# Altium project ctrl_board.PrjPCB
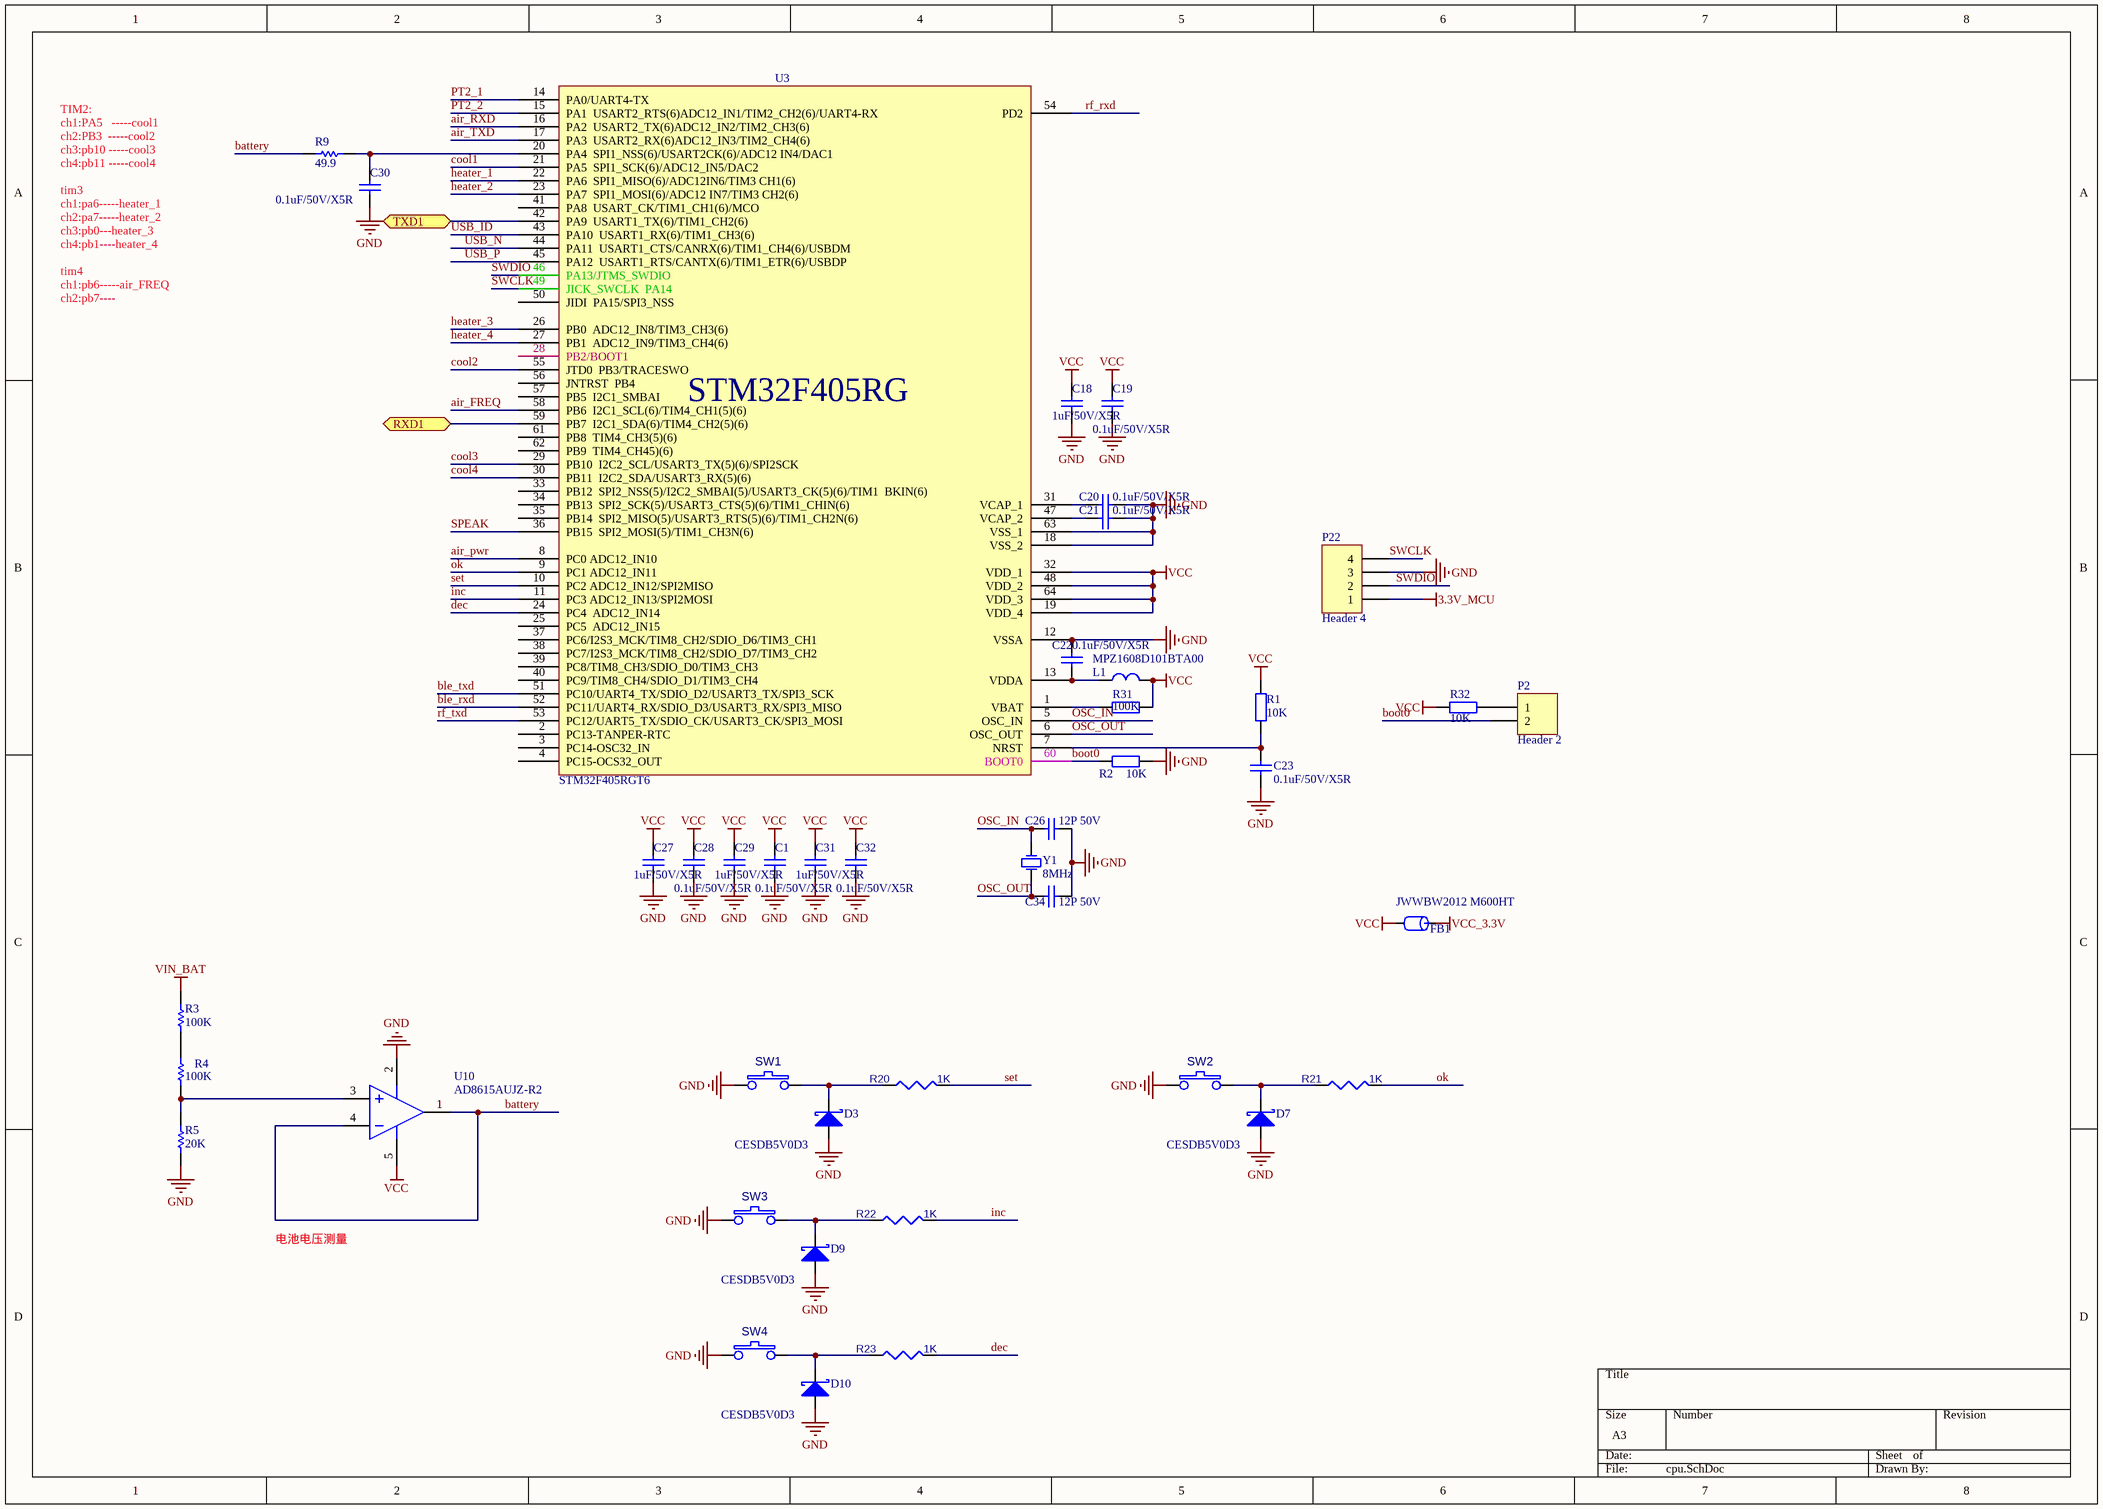
[diagram p0: cpu.SchDoc]
5 sheets, 103 parts. Net scope: global (net labels, ports and power ports of the same name join across sheets).
Board file: ctrl_board.PcbDoc
Sheets:
  cpu.SchDoc
  connector.SchDoc
  power.SchDoc
  drv.SchDoc
  pt100.SchDoc

## Sheet cpu.SchDoc
size A3

### Parts
C1  0.1uF/50V/X5R  [0603C]
C18  1uF/50V/X5R  [0603C]
C19  0.1uF/50V/X5R  [0603C]
C20  0.1uF/50V/X5R  [0603C]
C21  0.1uF/50V/X5R  [0603C]
C22  0.1uF/50V/X5R  [0603C]
C23  0.1uF/50V/X5R  [0603C]
C26  12P 50V  [0603C]
C27  1uF/50V/X5R  [0603C]
C28  0.1uF/50V/X5R  [0603C]
C29  1uF/50V/X5R  [0603C]
C30  0.1uF/50V/X5R  [0603C]
C31  1uF/50V/X5R  [0603C]
C32  0.1uF/50V/X5R  [0603C]
C34  12P 50V  [0603C]
D3  CESDB5V0D3  [SOD323]
D7  CESDB5V0D3  [SOD323]
D9  CESDB5V0D3  [SOD323]
D10  CESDB5V0D3  [SOD323]
FB1  JWWBW2012 M600HT  [0805CZ]
L1  MPZ1608D101BTA00  [0603R]
P2  Header 2  [HDR1X2]
P22  Header 4  [HDR1X4]
R1  10K  [0603R]
R2  10K  [0603R]
R3  100K  [0603R]
R4  100K  [0603R]
R5  20K  [0603R]
R9  49.9  [0603R]
R20  value 1K  [0603R]  (hidden comment: 1k/1%)
R21  value 1K  [0603R]  (hidden comment: 1k/1%)
R22  value 1K  [0603R]  (hidden comment: 1k/1%)
R23  value 1K  [0603R]  (hidden comment: 1k/1%)
R31  100K  [0603R]
R32  10K  [0603R]
SW1  SW PUSHBUTTON  [SW-SMD_L3.9-W3.0-P4.45]  (value not drawn)
SW2  SW PUSHBUTTON  [SW-SMD_L3.9-W3.0-P4.45]  (value not drawn)
SW3  SW PUSHBUTTON  [SW-SMD_L3.9-W3.0-P4.45]  (value not drawn)
SW4  SW PUSHBUTTON  [SW-SMD_L3.9-W3.0-P4.45]  (value not drawn)
U3  STM32F405RGT6  [LQFP-64]
U10  AD8615AUJZ-R2  [sot-23-5]
Y1  8MHz  [CRAY_5032]

### Ports
RXD1 (bidir), TXD1 (bidir)

### Nets
3.3V_MCU: P22.1
GND: C1.1 C18.1 C19.1 C20.1 C21.1 C22.1 C23.1 C26.1 C27.1 C28.1 C29.1 C30.1 C31.1 C32.1 C34.1 D3.1(A) D7.1(A) D9.1(A) D10.1(A) P22.3 R2.2 R5.2 SW1.1 SW2.1 SW3.1 SW4.1 U3.12(VSSA) U3.18(VSS_2) U3.63(VSS_1) U10.2(G)
VCC: C1.2 C18.2 C19.2 C27.2 C28.2 C29.2 C31.2 C32.2 FB1.2 L1.2 R1.1 R31.1 R32.2 U3.19(VDD_4) U3.32(VDD_1) U3.48(VDD_2) U3.64(VDD_3) U10.5(VCC)  [project net PT_VREF]
VCC_3.3V: FB1.1
VIN_BAT: R3.1
air_FREQ: U3.58(PB6__I2C1_SCL(6)/TIM4_CH1(5)(6))
air_pwr: U3.8(PC0_ADC12_IN10)
air_RXD: U3.16(PA2__USART2_TX(6)ADC12_IN2/TIM2_CH3(6))
air_TXD: U3.17(PA3__USART2_RX(6)ADC12_IN3/TIM2_CH4(6))
battery: R9.1 U10.1(OS_NUL) U10.4(V-)
ble_rxd: U3.52(PC11/UART4_RX/SDIO_D3/USART3_RX/SPI3_MISO)
ble_txd: U3.51(PC10/UART4_TX/SDIO_D2/USART3_TX/SPI3_SCK)
boot0: P2.2 R2.1 U3.60(BOOT0)
cool1: U3.21(PA5__SPI1_SCK(6)/ADC12_IN5/DAC2)
cool2: U3.55(JTD0__PB3/TRACESWO)
cool3: U3.29(PB10__I2C2_SCL/USART3_TX(5)(6)/SPI2SCK)
cool4: U3.30(PB11__I2C2_SDA/USART3_RX(5)(6))
dec: R23.2 U3.24(PC4__ADC12_IN14)
heater_1: U3.22(PA6__SPI1_MISO(6)/ADC12IN6/TIM3_CH1(6))
heater_2: U3.23(PA7__SPI1_MOSI(6)/ADC12_IN7/TIM3_CH2(6))
heater_3: U3.26(PB0__ADC12_IN8/TIM3_CH3(6))
heater_4: U3.27(PB1__ADC12_IN9/TIM3_CH4(6))
inc: R22.2 U3.11(PC3_ADC12_IN13/SPI2MOSI)
ok: R21.2 U3.9(PC1_ADC12_IN11)
OSC_IN: C26.2 U3.5(OSC_IN) Y1.2(OSC2)
OSC_OUT: C34.2 U3.6(OSC_OUT) Y1.1(OSC1)
PT2_1: U3.14(PA0/UART4-TX)
PT2_2: U3.15(PA1__USART2_RTS(6)ADC12_IN1/TIM2_CH2(6)/UART4-RX)
rf_rxd: U3.54(PD2)
rf_txd: U3.53(PC12/UART5_TX/SDIO_CK/USART3_CK/SPI3_MOSI)
set: R20.2 U3.10(PC2_ADC12_IN12/SPI2MISO)
SPEAK: U3.36(PB15__SPI2_MOSI(5)/TIM1_CH3N(6))
SWCLK: P22.4 U3.49(JICK_SWCLK__PA14)
SWDIO: P22.2 U3.46(PA13/JTMS_SWDIO)
USB_ID: U3.43(PA10__USART1_RX(6)/TIM1_CH3(6))
USB_N: U3.44(PA11__USART1_CTS/CANRX(6)/TIM1_CH4(6)/USBDM)
USB_P: U3.45(PA12__USART1_RTS/CANTX(6)/TIM1_ETR(6)/USBDP)
NetC20_2: C20.2 U3.31(VCAP_1)
NetC21_2: C21.2 U3.47(VCAP_2)
NetC22_2: C22.2 L1.1 U3.13(VDDA)
NetC23_2: C23.2 R1.2 U3.7(NRST)
NetC30_2: C30.2 R9.2 U3.20(PA4__SPI1_NSS(6)/USART2CK(6)/ADC12_IN4/DAC1)
NetD3_2: D3.2(K) R20.1 SW1.2
NetD7_2: D7.2(K) R21.1 SW2.2
NetD9_2: D9.2(K) R22.1 SW3.2
NetD10_2: D10.2(K) R23.1 SW4.2
NetP2_1: P2.1 R32.1
NetR3_2: R3.2 R4.1
NetR4_2: R4.2 R5.1 U10.3(V+)
NetR10_2: U3.42(PA9__USART1_TX(6)/TIM1_CH2(6)) ; port TXD1
NetR31_2: R31.2 U3.1(VBAT)
NetR63_2: U3.59(PB7__I2C1_SDA(6)/TIM4_CH2(5)(6)) ; port RXD1

Not connected (* = marked no-connect by the designer): U3 2(PC13-TANPER-RTC) 3(PC14-OSC32_IN) 4(PC15-OCS32_OUT) 25(PC5__ADC12_IN15) 28(PB2/BOOT1) 33(PB12__SPI2_NSS(5)/I2C2_SMBAI(5)/USART3_CK(5)(6)/TIM1__BKIN(6)) 34(PB13__SPI2_SCK(5)/USART3_CTS(5)(6)/TIM1_CHIN(6)) 35(PB14__SPI2_MISO(5)/USART3_RTS(5)(6)/TIM1_CH2N(6)) 37(PC6/I2S3_MCK/TIM8_CH2/SDIO_D6/TIM3_CH1) 38(PC7/I2S3_MCK/TIM8_CH2/SDIO_D7/TIM3_CH2) 39(PC8/TIM8_CH3/SDIO_D0/TIM3_CH3) 40(PC9/TIM8_CH4/SDIO_D1/TIM3_CH4) 41(PA8__USART_CK/TIM1_CH1(6)/MCO) 50(JIDI__PA15/SPI3_NSS) 56(JNTRST__PB4) 57(PB5__I2C1_SMBAI) 61(PB8__TIM4_CH3(5)(6)) 62(PB9__TIM4_CH45)(6))

### Notes on the sheet
- TIM2:
  ch1:PA5   -----cool1
  ch2:PB3  -----cool2
  ch3:pb10 -----cool3
  ch4:pb11 -----cool4
  tim3
  ch1:pa6-----heater_1
  ch2:pa7-----heater_2
  ch3:pb0---heater_3
  ch4:pb1----heater_4
  tim4
  ch1:pb6-----air_FREQ
  ch2:pb7----
- 电池电压测量

### Library data of the parts
C1 C18-C23 C26-C32 C34 = CAP4: 贴片电容 20%
D3 D7 D9 D10 = DIODE S: Schottky Diode
FB1 = FB: Part Field 1: 磁珠/0603/1K ohm/100MHz; Text Field1: FB; Value: JWWBW2012 M600HT
L1 = CIZHU1: 磁珠电感 100R 100MHz
P2 = Header 2: Header, 2-Pin; LatestRevisionDate: 17-Jul-2002; LatestRevisionNote: Re-released for DXP Platform.; Publisher: Altium Limited
P22 = Header 4: Header, 4-Pin; LatestRevisionDate: 17-Jul-2002; LatestRevisionNote: Re-released for DXP Platform.; Publisher: Altium Limited
R1 R2 R31 R32 = RES2: 贴片电阻 5%
R3-R5 R9 = Res1: Resistor; Published: 8-Jun-2000; LatestRevisionDate: 17-Jul-2002; LatestRevisionNote: Re-released for DXP Platform.; PackageReference: AXIAL-0.3; Publisher: Altium Limited
R20-R23 = RESISTOR_0: Part Reference: R70; SIGNAL_MODEL: DEFAULT_RESISTOR_200OHM_1_2; PCB Footprint: R0402
SW1-SW4 = SW PUSHBUTTON: Part Reference: SW2; PCB Footprint: KEY_3X6; Value: SW PUSHBUTTON
U3 = STM32F405RG: MCU
U10 = AD8615
Y1 = XTAL: 晶振

## Sheet connector.SchDoc
size A4
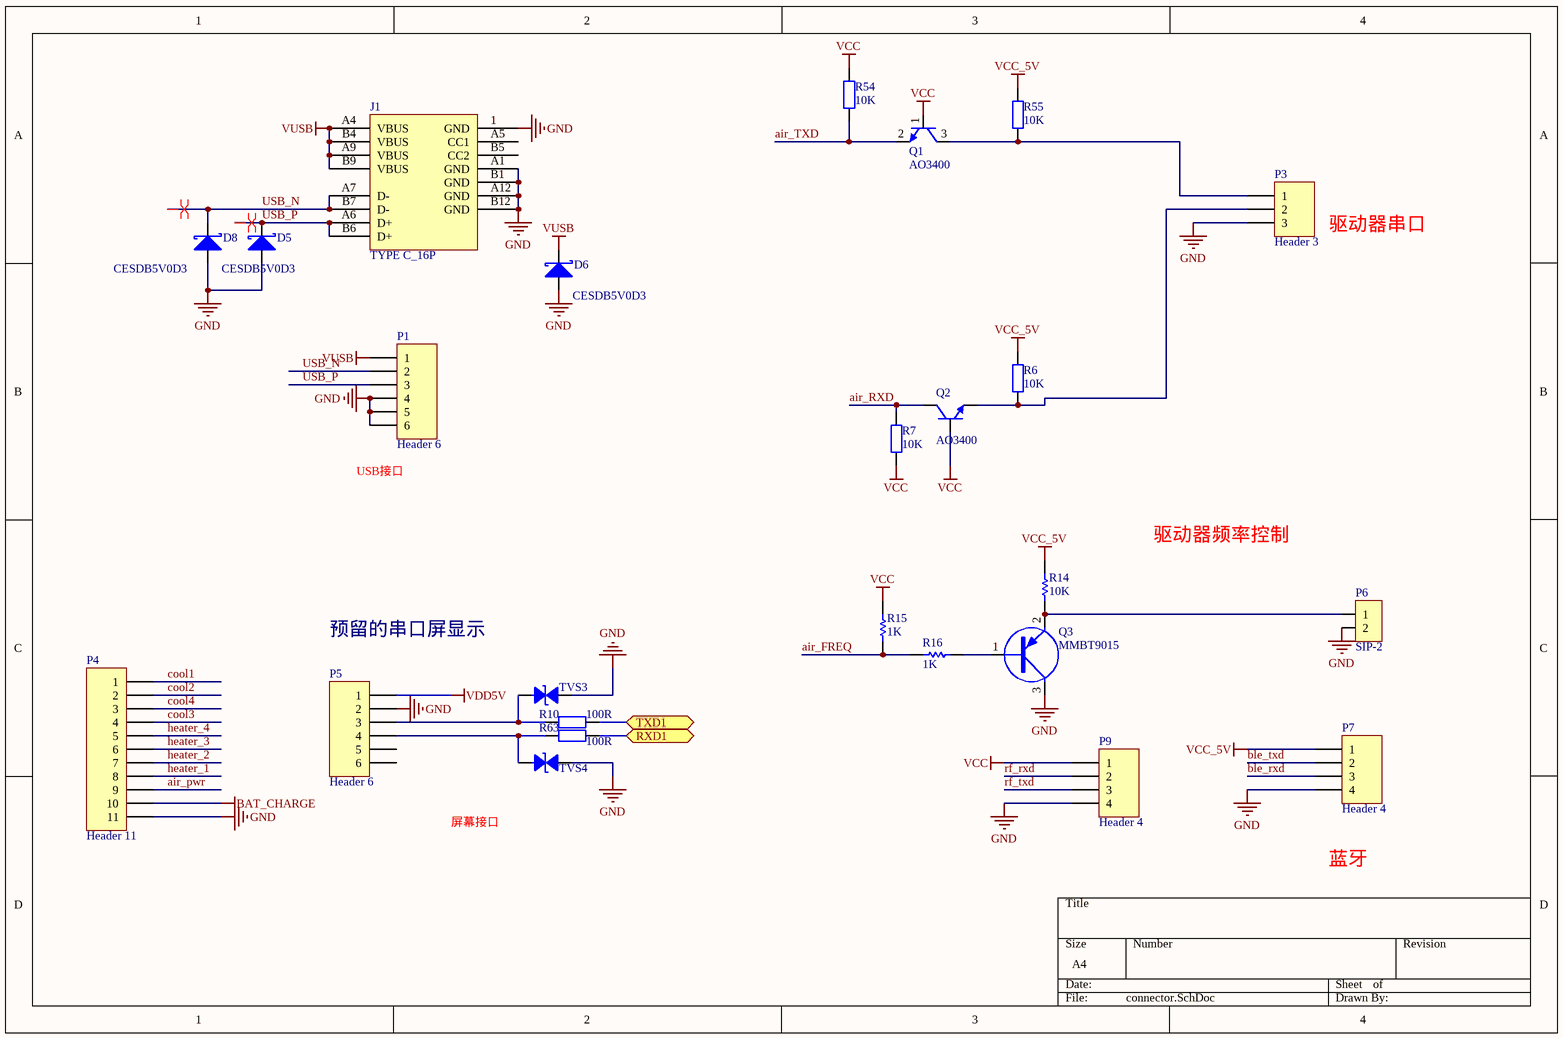
[diagram p1: connector.SchDoc]

### Parts
D5  CESDB5V0D3  [SOD323]
D6  CESDB5V0D3  [SOD323]
D8  CESDB5V0D3  [SOD323]
J1  TYPE C_16P  [TYPEC_16P]
P1  Header 6  [USB-A]
P3  Header 3  [3X2.54MMZ]
P4  Header 11  [12X2MMZ]
P5  Header 6  [6X2MMZ]
P6  SIP-2  [SIP-2A]
P7  Header 4  [4X2.54MMZ]
P9  Header 4  [4X2.54MMZ]
Q1  AO3400  [SOT-23]
Q2  AO3400  [SOT-23]
Q3  MMBT9015  [SOT23-3]
R6  10K  [0603r]
R7  10K  [0603r]
R10  100R  [0603R]
R14  10K  [0603R]
R15  1K  [0603R]
R16  1K  [0603R]
R54  10K  [0603r]
R55  10K  [0603r]
R63  100R  [0603R]
TVS3  ESD5Z5.0CT1G  [SOD-523]  (value not drawn)
TVS4  ESD5Z5.0CT1G  [SOD-523]  (value not drawn)

### Ports
RXD1 (bidir), TXD1 (bidir)

### Nets
BAT_CHARGE: P4.10
GND: D5.1(A) D6.1(A) D8.1(A) J1.1(GND) J1.A1(GND) J1.A12(GND) J1.B1(GND) J1.B12(GND) P1.4 P1.5 P1.6 P3.3 P4.11 P5.2 P6.2 P7.4 P9.4 Q3.3(C) TVS3.1(A) TVS4.1(A)
VCC: P9.1 Q1.1(B) Q2.1(B) R7.1 R15.1 R54.2  [project net PT_VREF]
VCC_5V: P7.1 R6.2 R14.2 R55.2
VDD5V: P5.1
VUSB: D6.2(K) J1.A4(VBUS) J1.A9(VBUS) J1.B4(VBUS) J1.B9(VBUS) P1.1
air_FREQ: R15.2 R16.2
air_pwr: P4.9
air_RXD: Q2.3(C) R7.2
air_TXD: Q1.2(E) R54.1
ble_rxd: P7.3
ble_txd: P7.2
cool1: P4.1
cool2: P4.2
cool3: P4.4
cool4: P4.3
heater_1: P4.8
heater_2: P4.7
heater_3: P4.6
heater_4: P4.5
rf_rxd: P9.2
rf_txd: P9.3
USB_N: D8.2(K) J1.A7(D-) J1.B7(D-) P1.2
USB_P: D5.2(K) J1.A6(D+) J1.B6(D+) P1.3
NetP3_1: P3.1 Q1.3(C) R55.1
NetP3_2: P3.2 Q2.2(E) R6.1
NetP5_3: P5.3 R10.1 TVS3.2(B)
NetP5_4: P5.4 R63.1 TVS4.2(B)
NetP6_1: P6.1 Q3.2(E) R14.1
NetQ3_1: Q3.1(B) R16.1
NetR10_2: R10.2 ; port TXD1
NetR63_2: R63.2 ; port RXD1

Not connected (* = marked no-connect by the designer): J1 A5(CC1) B5(CC2); P5 5 6

### Layout directives
differential pair: USB_N, USB_P

### Notes on the sheet
- 驱动器串口
- (near P1) USB接口
- 驱动器频率控制
- 预留的串口屏显示
- 屏幕接口
- 蓝牙

### Library data of the parts
D5 D6 D8 = DIODE S: Schottky Diode
P1 P5 = Header 6: Header, 6-Pin; LatestRevisionDate: 17-Jul-2002; LatestRevisionNote: Re-released for DXP Platform.; Publisher: Altium Limited
P3 = Header 3: Header, 3-Pin; LatestRevisionDate: 17-Jul-2002; LatestRevisionNote: Re-released for DXP Platform.; Publisher: Altium Limited
P4 = Header 11: Header, 11-Pin; LatestRevisionDate: 17-Jul-2002; LatestRevisionNote: Re-released for DXP Platform.; Publisher: Altium Limited
P6 = SIP-2: XH2.54 2P 立贴
P7 P9 = Header 4: Header, 4-Pin; LatestRevisionDate: 17-Jul-2002; LatestRevisionNote: Re-released for DXP Platform.; Publisher: Altium Limited
Q1 Q2 = NPN-1: NPN
Q3 = PNP
R6 R7 R54 R55 = R: 贴片电阻 1%
R10 R63 = RES2: 贴片电阻 5%
R14-R16 = Res1: Resistor; Published: 8-Jun-2000; LatestRevisionDate: 17-Jul-2002; LatestRevisionNote: Re-released for DXP Platform.; PackageReference: AXIAL-0.3; Publisher: Altium Limited
TVS3 TVS4 = TVS-1: TVS

## Sheet power.SchDoc
size A3
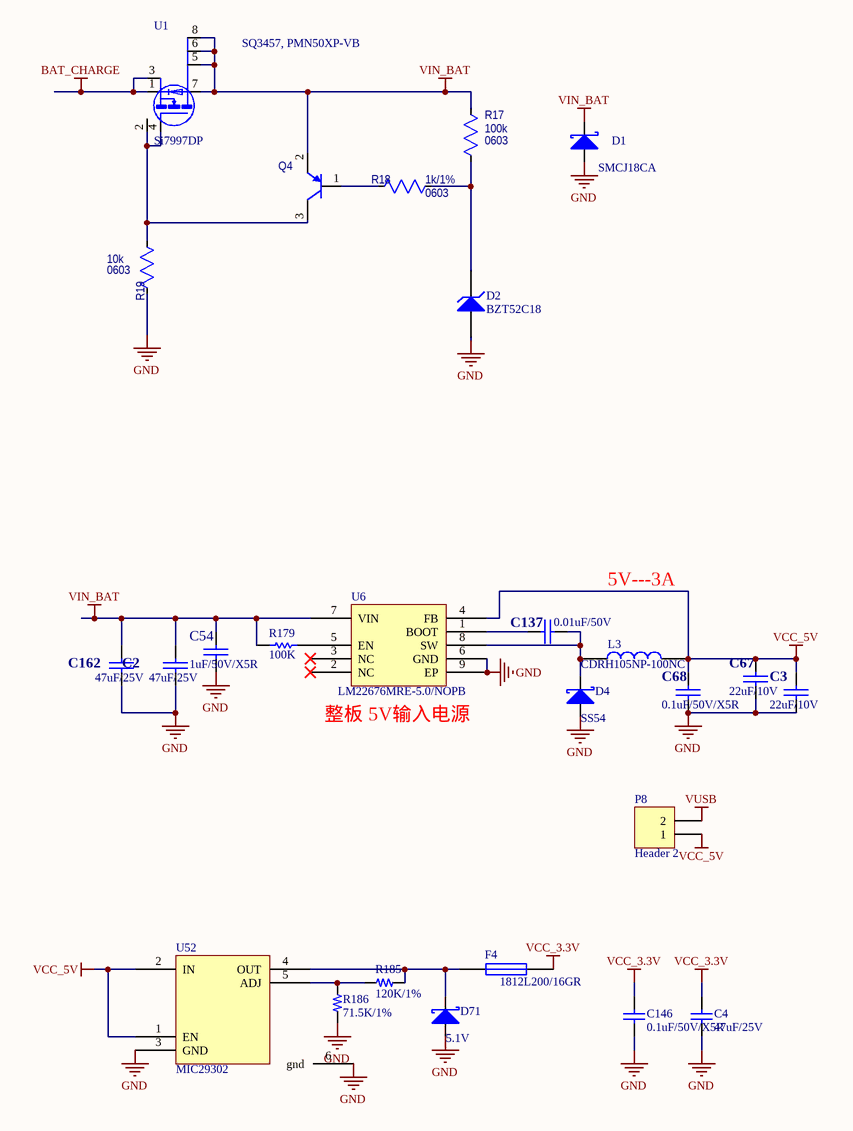
[diagram p2: power.SchDoc]

### Parts
C2  47uF/25V  [1210C]
C3  22uF/10V  [1210C]
C4  47uF/25V  [1206C]
C54  1uF/50V/X5R  [0603C]
C67  22uF/10V  [1210C]
C68  0.1uF/50V/X5R  [0603C]
C137  0.01uF/50V  [0603C]
C146  0.1uF/50V/X5R  [0603C]
C162  47uF/25V  [1210C]
D1  SMCJ18CA  [SMC]
D2  BZT52C18  [sod123]
D4  SS54  [SMC]
D71  5.1V  [SMA]
F4  1812L200/16GR  [1812-F]
L3  CDRH105NP-100NC  [CDRH105]
P8  Header 2  [HDR1X2]
Q4  MMBT4403-7-F  [SOT23-3]  (value not drawn)
R17  Package: 0603  [RESC1608X055N_0603]  (hidden comment: 100k)
R18  Package: 0603  [RESC1608X055N_0603]  (hidden comment: 1k/1%)
R19  Package: 0603  [RESC1608X055N_0603]  (hidden comment: 10k)
R179  100K  [0603R]
R185  120K/1%  [0603R]
R186  71.5K/1%  [0603R]
U1  Si7997DP  [PowerPAK SO-8]
U6  LM22676MRE-5.0/NOPB  [SOP127P600X168_HS-8N]
U52  MIC29302  [TO228P1435X457-6N]

### Nets
BAT_CHARGE: U1.1(S) U1.3(S)
GND: C2.2 C3.2 C4.1 C54.1 C67.2 C68.2 C146.1 C162.2 D1.1(A) D2.1(A) D4.1(A) D71.1(A) R19.2 R186.1 U6.6(GND) U6.9(EP) U52.3(GND) U52.6(gnd)
VCC_3.3V: C4.2 C146.2 F4.2
VCC_5V: C3.1 C67.1 C68.1 L3.2 P8.1 U6.4(FB) U52.1(EN) U52.2(IN)
VIN_BAT: C2.1 C54.2 C162.1 D1.2(K) Q4.2(E) R17.2 R179.2 U1.5(D) U1.6(D) U1.7(D) U1.8(D) U6.7(VIN)
VUSB: P8.2
NetC137_1: C137.1 D4.2(K) L3.1 U6.8(SW)
NetC137_2: C137.2 U6.1(BOOT)
NetD2_2: D2.2(K) R17.1 R18.1
NetD71_2: D71.2(K) F4.1 R185.1 U52.4(OUT)
NetQ4_1: Q4.1(B) R18.2
NetQ4_3: Q4.3(C) R19.1 U1.2(G) U1.4(G)
NetR179_1: R179.1 U6.5(EN)
NetR185_2: R185.2 R186.2 U52.5(ADJ)

Not connected (* = marked no-connect by the designer): U6 2(NC)* 3(NC)*

### Notes on the sheet
- SQ3457, PMN50XP-VB
- 5V---3A
- (near U6) 整板 5V输入电源

### Library data of the parts
C2 C3 C54 C67 C68 C137 C162 = CAP: Capacitor
C4 C146 = Cap: Capacitor; Value: 22nF; Published: 8-Jun-2000; LatestRevisionDate: 17-Jul-2002; LatestRevisionNote: Re-released for DXP Platform.; PackageReference: RAD-0.3; Publisher: Altium Limited; PackageDescription: Radial Cap, Thru-Hole; 2 Leads; 0.3 in Pin Spacing
D1 D4 D71 = DIODE S: Schottky Diode
D2 = BZT52C12S-7-F: Zener Current: 5mA; Vz - Zener Voltage: 12V; Pd - Power Dissipation: 200mW; Zz - Zener Impedance: 40Ohms; Unit Weight: 0.000173oz; Voltage Temperature Coefficient: 0.25mV/C; Voltage Tolerance: 5%; Package Reference: SOD323-2; Minimum Operating Temperature: -65C; Packaging: Reel; Product Category: ZenerDiodes; Termination Style: SMD/SMT; Mounting Style: SMD/SMT; RoHS: True; Package / Case: SOD-323; Package Description: 2-Pin Surface Mount Device, Body 1.7 x 1.3 mm; Width: 1.4mm; Mounting Technology: SurfaceMount; Package URL: http://www.vishay.com/docs/71192/71192.pdf; Series: BZT52C12; Value: BZT52C12S-7-F
F4 = Fuse 1: Fuse; Published: 8-Jun-2000; LatestRevisionDate: 17-Jul-2002; LatestRevisionNote: Re-released for DXP Platform.; PackageReference: PIN-W2/E2.8; Publisher: Altium Limited; PackageDescription: Thru-Hole; 2 Leads
L3 = INDUCTOR
P8 = Header 2: Header, 2-Pin; LatestRevisionDate: 17-Jul-2002; LatestRevisionNote: Re-released for DXP Platform.; Publisher: Altium Limited
Q4 = OEM_Diodes_MMBT4403: Supplier 1: *; Supplier Part Number 1: *; Value: MMBT4403-7-F
R17 = Resistor_0603: PartNumber: RC0603FR-0716K9L; Power Rating: [power]; TempCo: [tempco]; Tolerance: tol; Value: 100k; SupplierDescription: RES SMD 16.9K OHM 1% 1/10W 0603
R18 R19 = Resistor_0603: PartNumber: RC0603FR-071KL; Power Rating: [power]; TempCo: [tempco]; Tolerance: tol; SupplierDescription: RES SMD 1K OHM 1% 1/10W 0603
  R18: Value: 1k/1%
  R19: Value: 10k
R179 = Res1: Resistor; Published: 8-Jun-2000; LatestRevisionDate: 17-Jul-2002; LatestRevisionNote: Re-released for DXP Platform.; PackageReference: AXIAL-0.3; Publisher: Altium Limited
R185 R186 = R
U1 = Si7997DP: Sia430DJ
U6 = LM22676MR-5.0

## Sheet drv.SchDoc
size A4
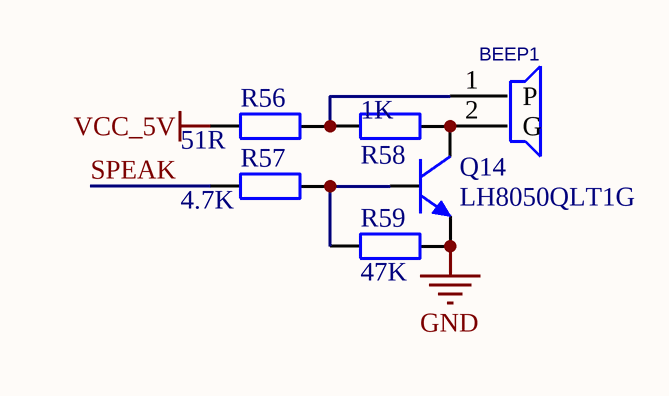
[diagram p3: drv.SchDoc]

### Parts
BEEP1  BEEP-9.5X5.5  [BEEP-9.5X5.5]  (value not drawn)
Q14  LH8050QLT1G  [SOT-23]
R56  51R  [0603R]
R57  4.7K  [0603R]
R58  1K  [0603R]
R59  47K  [0603R]

### Nets
GND: Q14.2(E) R59.2
VCC_5V: R56.2
SPEAK: R57.1
NetBEEP1_1: BEEP1.1(P) R56.1 R58.2
NetBEEP1_2: BEEP1.2(G) Q14.3(C) R58.1
NetQ14_1: Q14.1(B) R57.2 R59.1

### Library data of the parts
Q14 = NPN-1: NPN
R56-R59 = RES0: 贴片电阻 5%
BEEP1 = BEEP-9.5X5.5: PCB DECAL: BEEP-9.5X5.5

## Sheet pt100.SchDoc
size A4
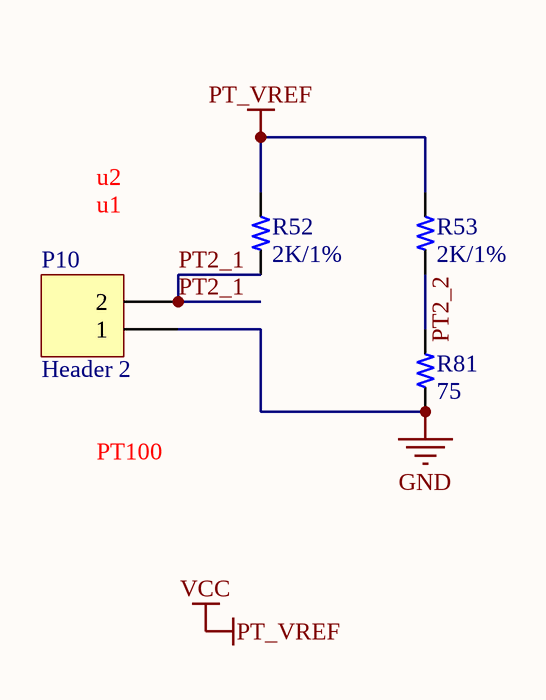
[diagram p4: pt100.SchDoc]

### Parts
P10  Header 2  [KF250NH-3.5-2P]
R52  2K/1%  [0603R]
R53  2K/1%  [0603R]
R81  75  [0603R]

### Nets
GND: P10.1 R81.1
PT_VREF: R52.2 R53.2  [also labelled VCC]
PT2_1: P10.2 R52.1
PT2_2: R53.1 R81.2

### Notes on the sheet
- (near P10) u1
- u2
- PT100

### Library data of the parts
R52 R53 R81 = R
  R52 R53: Value: 2K/1%
  R81: Value: 75
P10 = Header 2: Publisher: Altium Limited; Value: Header 2

## Nets that join several sheets
BAT_CHARGE: connector (P4.10), power (U1.1 U1.3)
GND: cpu (30 pins), connector (20 pins), power (18 pins), drv (Q14.2 R59.2), pt100 (P10.1 R81.1)
PT_VREF: cpu (18 pins), connector (6 pins), pt100 (R52.2 R53.2)
VCC_3.3V: cpu (FB1.1), power (C4.2 C146.2 F4.2)
VCC_5V: connector (P7.1 R6.2 R14.2 R55.2), power (8 pins), drv (R56.2)
VIN_BAT: cpu (R3.1), power (12 pins)
VUSB: connector (6 pins), power (P8.2)
air_FREQ: cpu (U3.58), connector (R15.2 R16.2)
air_pwr: cpu (U3.8), connector (P4.9)
air_RXD: cpu (U3.16), connector (Q2.3 R7.2)
air_TXD: cpu (U3.17), connector (Q1.2 R54.1)
ble_rxd: cpu (U3.52), connector (P7.3)
ble_txd: cpu (U3.51), connector (P7.2)
cool1: cpu (U3.21), connector (P4.1)
cool2: cpu (U3.55), connector (P4.2)
cool3: cpu (U3.29), connector (P4.4)
cool4: cpu (U3.30), connector (P4.3)
heater_1: cpu (U3.22), connector (P4.8)
heater_2: cpu (U3.23), connector (P4.7)
heater_3: cpu (U3.26), connector (P4.6)
heater_4: cpu (U3.27), connector (P4.5)
NetR10_2: cpu (U3.42), connector (R10.2)
NetR63_2: cpu (U3.59), connector (R63.2)
PT2_1: cpu (U3.14), pt100 (P10.2 R52.1)
PT2_2: cpu (U3.15), pt100 (R53.1 R81.2)
rf_rxd: cpu (U3.54), connector (P9.2)
rf_txd: cpu (U3.53), connector (P9.3)
SPEAK: cpu (U3.36), drv (R57.1)
USB_N: cpu (U3.44), connector (D8.2 J1.A7 J1.B7 P1.2)
USB_P: cpu (U3.45), connector (D5.2 J1.A6 J1.B6 P1.3)